# EAGLE design DAQ (EAGLE 6.5.0)
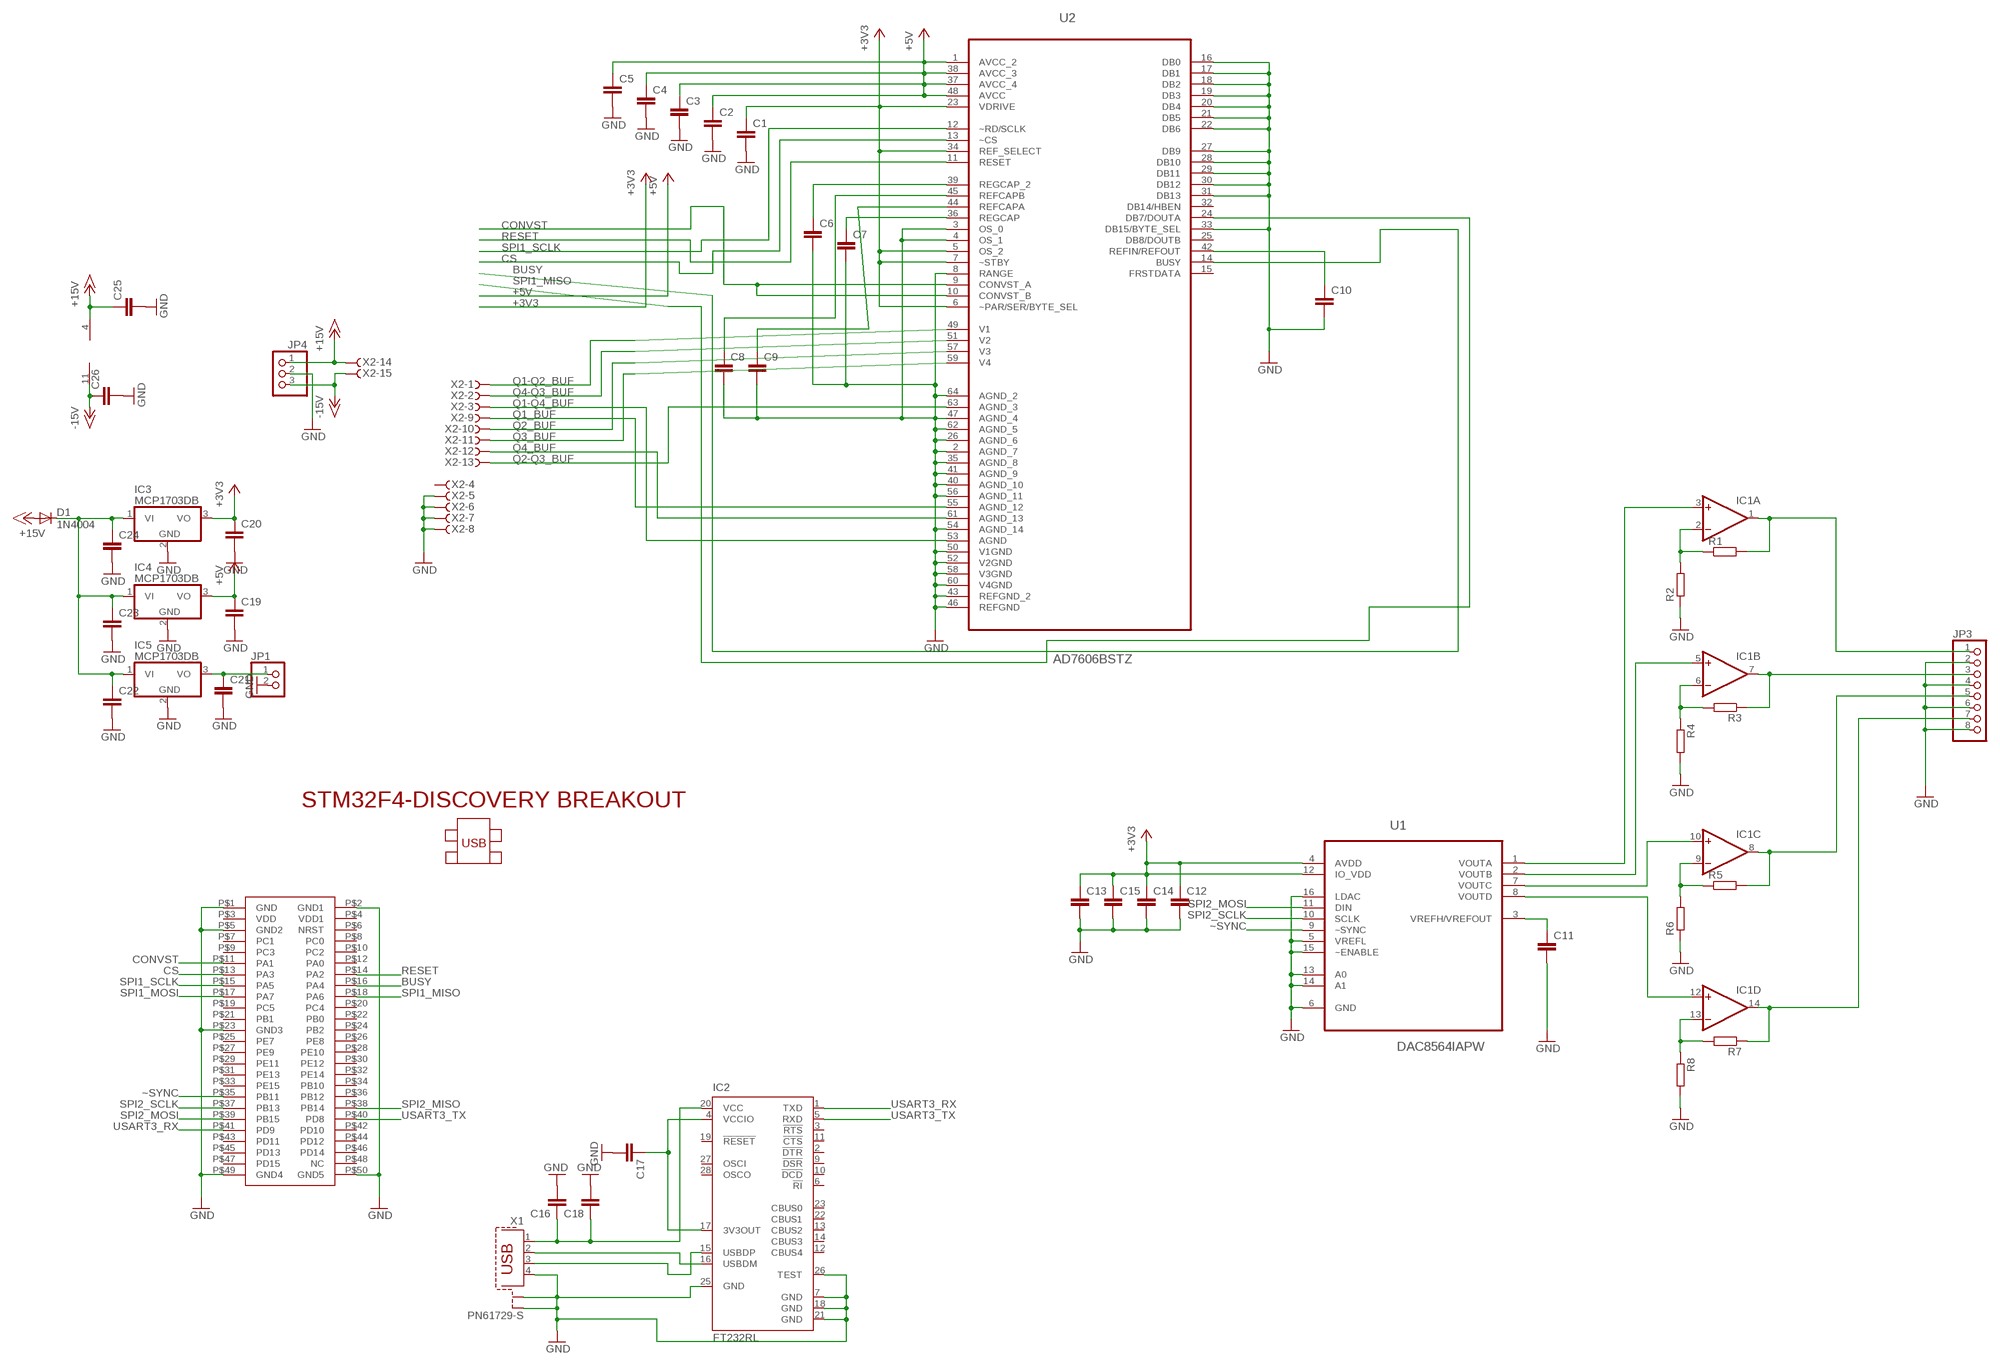
[diagram p0: schematic, sheet 1]

## Parts
C1  C-EUC0805  [C0805]
C2  C-EUC0805  [C0805]
C3  C-EUC0805  [C0805]
C4  C-EUC0805  [C0805]
C5  C-EUC0805  [C0805]
C6  C-EUC0805  [C0805]
C7  C-EUC0805  [C0805]
C8  C-EUC0805K  [C0805K]
C9  C-EUC0805K  [C0805K]
C10  C-EUC0805K  [C0805K]
C11  C-EUC0805  [C0805]
C12  C-EUC0805  [C0805]
C13  C-EUC0805  [C0805]
C14  C-EUC0805  [C0805]
C15  C-EUC0805  [C0805]
C16  C-EUC0805  [C0805]
C17  C-EUC0805  [C0805]
C18  C-EUC0805  [C0805]
C19  C-EUC0805K  [C0805K]
C20  C-EUC0805K  [C0805K]
C21  C-EUC0805K  [C0805K]
C22  C-EUC0805K  [C0805K]
C23  C-EUC0805K  [C0805K]
C24  C-EUC0805K  [C0805K]
C25  C-EUC0805K  [C0805K]
C26  C-EUC0805K  [C0805K]
D1  1N4004  [DO41-10]
IC1  4AMP_P4+11D  [SO14]
IC2  FT232RL  [SSOP28]
IC3  MCP1703DB  [SOT223]
IC4  MCP1703DB  [SOT223]
IC5  MCP1703DB  [SOT223]
JP1  PINHD-1X2  [1X02]
JP3  PINHD-1X8  [1X08]
JP4  PINHD-1X3  [1X03]
R1  R-EU_M0805  [M0805]
R2  R-EU_M0805  [M0805]
R3  R-EU_M0805  [M0805]
R4  R-EU_M0805  [M0805]
R5  R-EU_M0805  [M0805]
R6  R-EU_M0805  [M0805]
R7  R-EU_M0805  [M0805]
R8  R-EU_M0805  [M0805]
U1  DAC8564IAPW  [SOP65P640X120-16N]
U2  AD7606BSTZ  [QFP50P1200X1200X160-64N]
U$1  STM32F4-DISCOVERY  [STM32F4-DISCOVERY]
X1  PN61729-S  [PN61729-S]
X2  F15HDHS  [HDF15H]

## Nets
+3V3: C1.1 C12.1 C13.1 C14.1 C15.1 C20.1 IC3.3(VO) U1.4(AVDD) U1.12(IO_VDD) U2.5(OS_2) U2.6(~PAR/SER/BYTE_SEL) U2.7(~STBY) U2.23(VDRIVE) U2.34(REF_SELECT)
+5V: C2.1 C3.1 C4.1 C5.1 C19.1 IC4.3(VO) U2.1(AVCC_2) U2.37(AVCC_4) U2.38(AVCC_3) U2.48(AVCC)
+15V: C25.1 D1.A IC1.4(P:V+) JP4.1 X2.14
-15V: C26.1 IC1.11(P:V-) JP4.3 X2.15
BUSY: U2.14(BUSY) U$1.P$16(PA4)
CONVST: U2.9(CONVST_A) U2.10(CONVST_B) U$1.P$11(PA1)
CS: U2.13(~CS) U$1.P$13(PA3)
GND: C1.2 C2.2 C3.2 C4.2 C5.2 C6.2 C7.2 C8.2 C9.2 C10.2 C11.2 C12.2 C13.2 C14.2 C15.2 C16.2 C17.2 C18.2 C19.2 C20.2 C21.2 C22.2 C23.2 C24.2 C25.2 C26.2 IC2.7(GND) IC2.18(GND) IC2.21(GND) IC2.25(GND) IC2.26(TEST) IC3.2(GND) IC4.2(GND) IC5.2(GND) JP1.2 JP3.2 JP3.4 JP3.6 JP3.8 JP4.2 R2.1 R4.2 R6.1 R8.2 U1.5(VREFL) U1.6(GND) U1.13(A0) U1.14(A1) U1.15(~ENABLE) U1.16(LDAC) U2.2(AGND_7) U2.3(OS_0) U2.4(OS_1) U2.8(RANGE) U2.16(DB0) U2.17(DB1) U2.18(DB2) U2.19(DB3) U2.20(DB4) U2.21(DB5) U2.22(DB6) U2.26(AGND_6) U2.27(DB9) U2.28(DB10) U2.29(DB11) U2.30(DB12) U2.31(DB13) U2.33(DB15/BYTE_SEL) U2.35(AGND_8) U2.40(AGND_10) U2.41(AGND_9) U2.43(REFGND_2) U2.46(REFGND) U2.47(AGND_4) U2.50(V1GND) U2.52(V2GND) U2.54(AGND_14) U2.56(AGND_11) U2.58(V3GND) U2.60(V4GND) U2.62(AGND_5) U2.64(AGND_2) U$1.P$1(GND) U$1.P$2(GND1) U$1.P$5(GND2) U$1.P$23(GND3) U$1.P$49(GND4) U$1.P$50(GND5) X1.4 X1.S1 X1.S2 X2.5 X2.6 X2.7 X2.8
N$1: C16.1 C18.1 IC2.20(VCC) X1.1
N$2: IC2.16(USBDM) X1.2
N$3: IC2.15(USBDP) X1.3
N$5: IC1.3(A:+IN) U1.1(VOUTA)
N$6: IC1.5(B:+IN) U1.2(VOUTB)
N$7: C7.1 U2.36(REGCAP)
N$8: C8.1 U2.45(REFCAPB)
N$9: C9.1 U2.44(REFCAPA)
N$10: C6.1 U2.39(REGCAP_2)
N$11: C17.1 IC2.4(VCCIO) IC2.17(3V3OUT)
N$12: C21.1 IC5.3(VO) JP1.1
N$15: C10.1 U2.42(REFIN/REFOUT)
N$16: IC1.10(C:+IN) U1.7(VOUTC)
N$17: IC1.12(D:+IN) U1.8(VOUTD)
N$18: C11.1 U1.3(VREFH/VREFOUT)
N$19: IC1.1(A:OUT) JP3.1 R1.2
N$20: IC1.2(A:-IN) R1.1 R2.2
N$21: IC1.7(B:OUT) JP3.3 R3.1
N$22: IC1.6(B:-IN) R3.2 R4.1
N$23: IC1.8(C:OUT) JP3.5 R5.2
N$24: IC1.9(C:-IN) R5.1 R6.2
N$25: IC1.14(D:OUT) JP3.7 R7.1
N$26: IC1.13(D:-IN) R7.2 R8.1
N$29: C22.1 C23.1 C24.1 D1.C IC3.1(VI) IC4.1(VI) IC5.1(VI)
Q1-Q2_BUF: U2.49(V1) X2.1
Q1-Q4_BUF: U2.53(AGND) X2.3
Q1_BUF: U2.55(AGND_12) X2.9
Q2-Q3_BUF: U2.63(AGND_3) X2.13
Q2_BUF: U2.57(V3) X2.10
Q3_BUF: U2.59(V4) X2.11
Q4-Q3_BUF: U2.51(V2) X2.2
Q4_BUF: U2.61(AGND_13) X2.12
RESET: U2.11(RESET) U$1.P$14(PA2)
SPI1_MISO: U2.24(DB7/DOUTA) U$1.P$18(PA6)
SPI1_MOSI: U$1.P$17(PA7)
SPI1_SCLK: U2.12(~RD/SCLK) U$1.P$15(PA5)
SPI2_MISO: U$1.P$38(PB14)
SPI2_MOSI: U1.11(DIN) U$1.P$39(PB15)
SPI2_SCLK: U1.10(SCLK) U$1.P$37(PB13)
USART3_RX: IC2.1(TXD) U$1.P$41(PD9)
USART3_TX: IC2.5(RXD) U$1.P$40(PD8)
~SYNC: U1.9(~SYNC) U$1.P$35(PB11)
Unconnected: IC2.2(!DTR) IC2.3(!RTS) IC2.6(!RI) IC2.9(!DSR) IC2.10(!DCD) IC2.11(!CTS) IC2.12(CBUS4) IC2.13(CBUS2) IC2.14(CBUS3) IC2.19(!RESET) IC2.22(CBUS1) IC2.23(CBUS0) IC2.27(OSCI) IC2.28(OSCO) U2.15(FRSTDATA) U2.25(DB8/DOUTB) U2.32(DB14/HBEN) U$1.P$3(VDD) U$1.P$4(VDD1) U$1.P$6(NRST) U$1.P$7(PC1) U$1.P$8(PC0) U$1.P$9(PC3) U$1.P$10(PC2) U$1.P$12(PA0) U$1.P$19(PC5) U$1.P$20(PC4) U$1.P$21(PB1) U$1.P$22(PB0) U$1.P$24(PB2) U$1.P$25(PE7) U$1.P$26(PE8) U$1.P$27(PE9) U$1.P$28(PE10) U$1.P$29(PE11) U$1.P$30(PE12) U$1.P$31(PE13) U$1.P$32(PE14) U$1.P$33(PE15) U$1.P$34(PB10) U$1.P$36(PB12) U$1.P$42(PD10) U$1.P$43(PD11) U$1.P$44(PD12) U$1.P$45(PD13) U$1.P$46(PD14) U$1.P$47(PD15) U$1.P$48(NC) X2.4

## Library data of the parts
C1-C26 = resistor:C-EU: CAPACITOR, European symbol
D1 = diode:1N4004: DIODE general purpose rectifier, 1 A
IC1 = linear:4AMP_P4+11: OP AMP
IC2 = ftdichip:FT232R: Source: http://www.ftdichip.com/Documents/DataSheets/DS_FT232R_v104.pdf; MPN: FT232RL; OC_FARNELL: 1146032; OC_NEWARK: 91K9918
IC3-IC5 = linear:MCP1703: 250 mA, 16V, Low Quiescent Current LDO Regulator Source: http://ww1.microchip.com/downloads/en/DeviceDoc/22049b.pdf
JP1 = pinhead:PINHD-1X2: PIN HEADER
JP3 = pinhead:PINHD-1X8: PIN HEADER
JP4 = pinhead:PINHD-1X3: PIN HEADER
R1-R8 = resistor:R-EU_: RESISTOR, European symbol
U1 = DAC8564:DAC8564IAPW: DAC; MPN: DAC8564IAPW; OC_FARNELL: 1536691; OC_NEWARK: 65M0703; PACKAGE: TSSOP-16; SUPPLIER: Texas Instruments
U2 = ad7606:AD7606BSTZ: Bipolar Input, Simultaneous Sampling ADC; MPN: AD7606BSTZ; OC_FARNELL: 1864685; OC_NEWARK: 76R7614; PACKAGE: LQFP-64; SUPPLIER: Analog Devices
U$1 = STM32F4-DISCOVERY:STM32F4-DISCOVERY
X1 = con-berg:PN61729-S: BERG USB connector; OC_FARNELL: unknown; OC_NEWARK: unknown
X2 = con-subd:F15?S: SUB-D; OC_FARNELL: unknown; OC_NEWARK: unknown

## Board
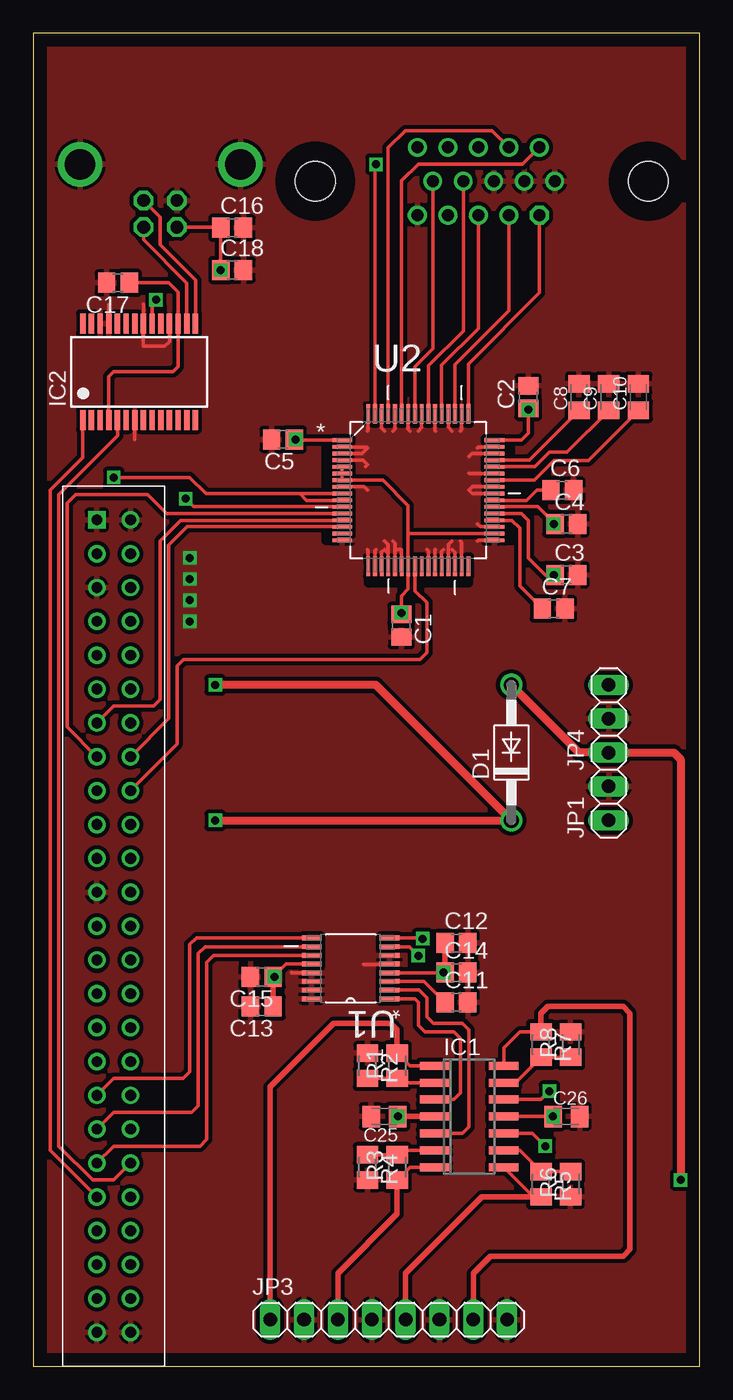
[diagram p1: board, top side]
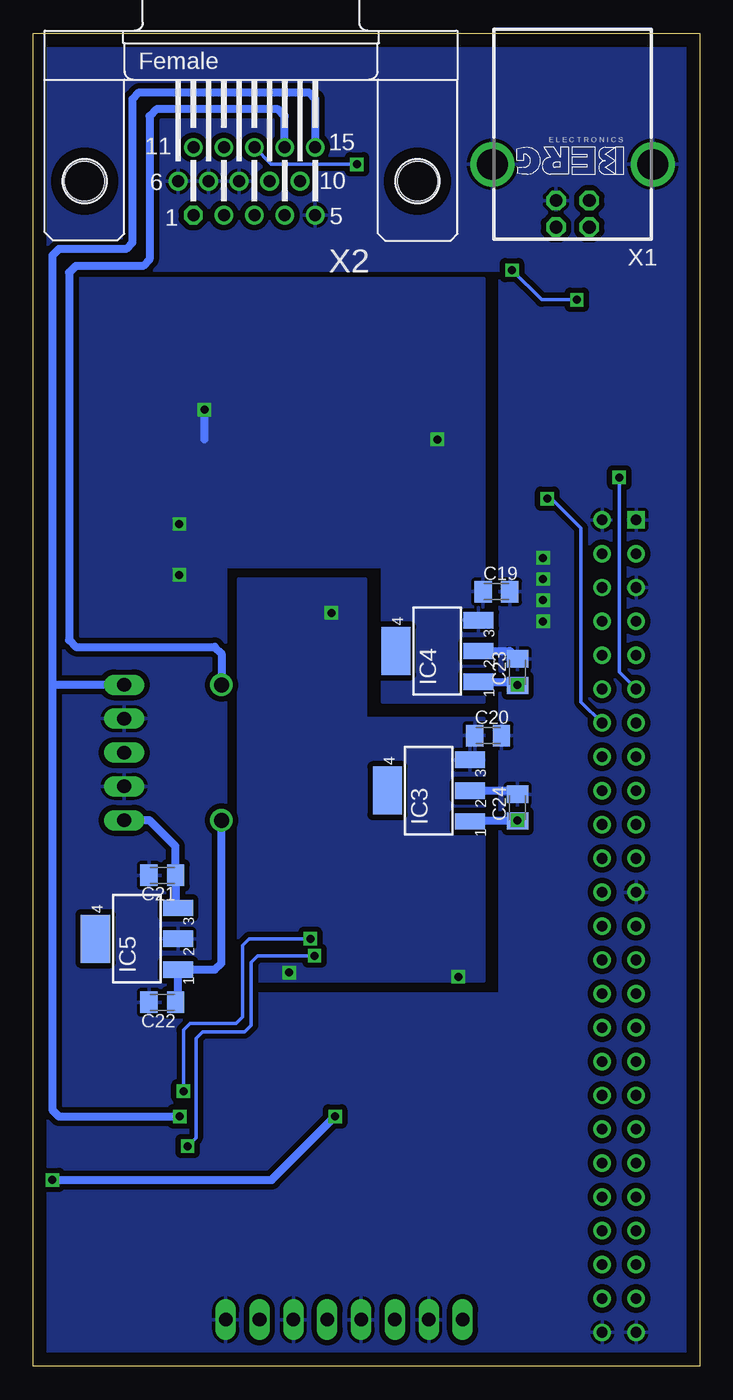
[diagram p2: board, bottom side, seen from below]

Size 50 x 100 mm. Coordinates in mm from the lower left corner, seen from the top.
Outline: 0,0 50,0 50,100 0,100 0,0
Copper layers (1*16): Top 0.035mm / dielectric 1.5mm / Bottom 0.035mm
Design rules "default": minimum track width 10mil, minimum drill 24mil, track to track 8mil, track to pad 8mil, pad to pad 8mil, via to via 8mil, smd to smd 8mil, copper to edge 40mil, drill to drill 8mil, minimum pad ring 10mil, minimum via ring 8mil, stop-mask expansion 4mil, vias tented up to drill 0mil, thermal gap 10mil
tRestrict: area 22.5,67.6 to 23.8,69.5; area 25.1,70.8 to 27,72.1; area 34,68.3 to 35.2,68.9; area 34,65.1 to 35.2,66.4; area 29.5,59.4 to 32.7,60.6; area 25.1,59.4 to 27.6,60.6; area 25.1,59.4 to 25.7,60.6; area 28.9,70.8 to 31.4,72.1; area 25.1,58.7 to 32.7,59.4; area 35.2,61.9 to 35.9,69.5; area 21.9,61.9 to 22.5,69.5

### Footprints (pad centres in the part's own frame; a part is rotated, then mirrored left to right if it is on the bottom)
C0805 = smd 1.3 x 1.5: 1 -0.85,0; 2 0.85,0
C0805K = smd 1.3 x 1.6: 1 -1,0; 2 1,0
DO41-10 = drill 1.118: A 5.08,0; C -5.08,0
SO14 = smd 0.6 x 2.2: 1 -3.81,-2.6; 2 -2.54,-2.6; 3 -1.27,-2.6; 4 0,-2.6; 5 1.27,-2.6; 6 2.54,-2.6; 7 3.81,-2.6; 8 3.81,2.6; 9 2.54,2.6; 10 1.27,2.6; 11 0,2.6; 12 -1.27,2.6; 13 -2.54,2.6; 14 -3.81,2.6
SSOP28 = smd 0.4 x 1.5: 1 -4.225,-3.625; 2 -3.575,-3.625; 3 -2.925,-3.625; 4 -2.275,-3.625; 5 -1.625,-3.625; 6 -0.975,-3.625; 7 -0.325,-3.625; 8 0.325,-3.625; 9 0.975,-3.625; 10 1.625,-3.625; 11 2.275,-3.625; 12 2.925,-3.625; 13 3.575,-3.625; 14 4.225,-3.625; 15 4.225,3.625; 16 3.575,3.625; 17 2.925,3.625; 18 2.275,3.625; 19 1.625,3.625; 20 0.975,3.625; 21 0.325,3.625; 22 -0.325,3.625; 23 -0.975,3.625; 24 -1.625,3.625; 25 -2.275,3.625; 26 -2.925,3.625; 27 -3.575,3.625; 28 -4.225,3.625
SOT223 = smd 1.219 x 2.235: 1 -2.311,-3.099; 2 0,-3.099; 3 2.311,-3.099 | smd 3.6 x 2.2: 4 0,3.099
1X02 = drill 1.016 long: 1 -1.27,0; 2 1.27,0
1X08 = drill 1.016 long: 1 -8.89,0; 2 -6.35,0; 3 -3.81,0; 4 -1.27,0; 5 1.27,0; 6 3.81,0; 7 6.35,0; 8 8.89,0
1X03 = drill 1.016 long: 1 -2.54,0; 2 0,0; 3 2.54,0
M0805 = smd 1.3 x 1.6: 1 -0.95,0; 2 0.95,0
SOP65P640X120-16N = smd 1.473 x 0.356: 1 -2.921,2.286; 2 -2.921,1.626; 3 -2.921,0.965; 4 -2.921,0.33; 5 -2.921,-0.33; 6 -2.921,-0.965; 7 -2.921,-1.626; 8 -2.921,-2.286; 9 2.921,-2.286; 10 2.921,-1.626; 11 2.921,-0.965; 12 2.921,-0.33; 13 2.921,0.33; 14 2.921,0.965; 15 2.921,1.626; 16 2.921,2.286
QFP50P1200X1200X160-64N = smd 1.473 x 0.279: 1 -5.715,3.759; 2 -5.715,3.251; 3 -5.715,2.743; 4 -5.715,2.261; 5 -5.715,1.753; 6 -5.715,1.245; 7 -5.715,0.762; 8 -5.715,0.254; 9 -5.715,-0.254; 10 -5.715,-0.762; 11 -5.715,-1.245; 12 -5.715,-1.753; 13 -5.715,-2.261; 14 -5.715,-2.743; 15 -5.715,-3.251; 16 -5.715,-3.759; 33 5.715,-3.759; 34 5.715,-3.251; 35 5.715,-2.743; 36 5.715,-2.261; 37 5.715,-1.753; 38 5.715,-1.245; 39 5.715,-0.762; 40 5.715,-0.254; 41 5.715,0.254; 42 5.715,0.762; 43 5.715,1.245; 44 5.715,1.753; 45 5.715,2.261; 46 5.715,2.743; 47 5.715,3.251; 48 5.715,3.759 | smd 0.279 x 1.473: 17 -3.759,-5.715; 18 -3.251,-5.715; 19 -2.743,-5.715; 20 -2.261,-5.715; 21 -1.753,-5.715; 22 -1.245,-5.715; 23 -0.762,-5.715; 24 -0.254,-5.715; 25 0.254,-5.715; 26 0.762,-5.715; 27 1.245,-5.715; 28 1.753,-5.715; 29 2.261,-5.715; 30 2.743,-5.715; 31 3.251,-5.715; 32 3.759,-5.715; 49 3.759,5.715; 50 3.251,5.715; 51 2.743,5.715; 52 2.261,5.715; 53 1.753,5.715; 54 1.245,5.715; 55 0.762,5.715; 56 0.254,5.715; 57 -0.254,5.715; 58 -0.762,5.715; 59 -1.245,5.715; 60 -1.753,5.715; 61 -2.261,5.715; 62 -2.743,5.715; 63 -3.251,5.715; 64 -3.759,5.715
STM32F4-DISCOVERY = drill 0.8 square: P$1 -1.27,30.48 | drill 0.8: P$2 1.27,30.48; P$3 -1.27,27.94; P$4 1.27,27.94; P$5 -1.27,25.4; P$6 1.27,25.4; P$7 -1.27,22.86; P$8 1.27,22.86; P$9 -1.27,20.32; P$10 1.27,20.32; P$11 -1.27,17.78; P$12 1.27,17.78; P$13 -1.27,15.24; P$14 1.27,15.24; P$15 -1.27,12.7; P$16 1.27,12.7; P$17 -1.27,10.16; P$18 1.27,10.16; P$19 -1.27,7.62; P$20 1.27,7.62; P$21 -1.27,5.08; P$22 1.27,5.08; P$23 -1.27,2.54; P$24 1.27,2.54; P$25 -1.27,0; P$26 1.27,0; P$27 -1.27,-2.54; P$28 1.27,-2.54; P$29 -1.27,-5.08; P$30 1.27,-5.08; P$31 -1.27,-7.62; P$32 1.27,-7.62; P$33 -1.27,-10.16; P$34 1.27,-10.16; P$35 -1.27,-12.7; P$36 1.27,-12.7; P$37 -1.27,-15.24; P$38 1.27,-15.24; P$39 -1.27,-17.78; P$40 1.27,-17.78; P$41 -1.27,-20.32; P$42 1.27,-20.32; P$43 -1.27,-22.86; P$44 1.27,-22.86; P$45 -1.27,-25.4; P$46 1.27,-25.4; P$47 -1.27,-27.94; P$48 1.27,-27.94; P$49 -1.27,-30.48; P$50 1.27,-30.48
PN61729-S = drill 0.95 octagon: 1 1.25,4.71; 2 -1.25,4.71; 3 -1.25,2.71; 4 1.25,2.71 | drill 2.3 pad 2.9: S1 -6.02,0; S2 6.02,0
HDF15H = drill 0.9 octagon: 1 4.329,2.54 | drill 0.9: 2 2.043,2.54; 3 -0.243,2.54; 4 -2.529,2.54; 5 -4.815,2.54; 6 5.472,0; 7 3.186,0; 8 0.9,0; 9 -1.386,0; 10 -3.672,0; 11 4.329,-2.54; 12 2.043,-2.54; 13 -0.243,-2.54; 14 -2.529,-2.54; 15 -4.815,-2.54 | hole 3: -12.5,0; 12.5,0

### Placement (x,y rotation side)
C1  27.62,55.56 270 top
C2  37.15,72.71 90 top
C3  40.01,59.37 0 top
C4  40.01,63.18 0 top
C5  18.73,69.53 180 top
C6  39.69,65.72 0 top
C7  39.05,56.83 0 top
C8  40.96,72.71 90 top
C9  43.18,72.71 90 top
C10  45.4,72.71 90 top
C11  31.75,27.3 0 top
C12  31.75,31.75 0 top
C13  17.14,26.99 180 top
C14  31.75,29.53 0 top
C15  17.14,29.21 180 top
C16  14.92,85.41 0 top
C17  6.35,81.28 180 top
C18  14.92,82.23 0 top
C19  15.24,58.1 0 bottom
C20  15.88,47.31 0 bottom
C21  40.32,36.83 180 bottom
C22  40.32,27.3 180 bottom
C23  13.65,52.07 90 bottom
C24  13.65,41.91 90 bottom
C25  26.35,18.73 180 top
C26  40.01,18.73 0 top
D1  35.88,46.04 90 top
IC1  32.7,18.73 270 top
IC2  7.94,74.61 0 top
IC3  20.32,43.18 90 bottom
IC4  19.68,53.66 90 bottom
IC5  42.23,32.07 90 bottom
JP1  43.18,42.23 90 top
JP3  26.67,3.49 0 top
JP4  43.18,48.58 90 top
R1  27.3,22.54 90 top
R2  25.08,22.54 270 top
R3  27.3,14.92 90 top
R4  25.08,14.92 270 top
R5  38.1,13.65 270 top
R6  40.32,13.65 90 top
R7  38.1,24.13 270 top
R8  40.32,24.13 90 top
U1  23.81,29.84 180 top
U2  28.89,65.72 0 top
U$1  6.03,33.02 0 top
X1  9.53,90.17 180 bottom
X2  33.66,88.9 180 bottom

### Tracks (layer width: path | path; a pad name or v marks a point on that pad's centre or on a via)
+3V3  (via drill 0.6)
  Top 0.254: 28.13,56.92 C1.1 | v27.62,56.52 27.62,57.78 28.13,58.29 U2.23 28.13,62.55 | 28.13,62.55 28.13,64.58 26.23,66.48 U2.7 U2.6 U2.5 | U2.34 28.21,62.47 28.13,62.55 | U1.12 18.96,30.18 C15.1 v18.1,29.21 | U1.4 30.81,29.52 | C14.1 30.89,29.52 30.81,29.52 | 30.81,29.52 v30.8,29.53
  Top 0.406: C15.1 C13.1 | C12.1 C14.1
  Top 0.61: C1.1 v27.62,56.52
  pour Bottom (isolate 0.406): 16.19,48.58 25.08,48.58 25.08,59.05 34.61,59.05 34.61,28.89 16.19,28.89
+5V  (via drill 0.6)
  Top 0: v19.68,69.53 C5.1 | v39.05,63.18 C4.1 | v39.05,59.37 C3.1
  Top 0.254: 19.58,69.48 C5.1 | 37.15,70.75 v37.15,71.75 | v37.15,71.75 C2.1 | U2.48 36.64,69.48 37.15,69.99 v37.15,71.75 | U2.38 37.86,64.48 C4.1 | U2.37 36.64,63.97 37.15,63.46 37.15,60.64 38.42,59.37 v39.05,59.37 | U2.1 20.05,69.48 v19.68,69.53
  Bottom 0.61: 37.15,69.53 v37.15,71.75
  pour Bottom (isolate 0.406): 16.19,81.6 50.16,81.6 50.16,54.29 35.56,54.29 35.56,60.01 23.81,60.01 23.81,49.85 16.19,49.85
+15V  (via drill 0.6)
  Top 0.406: 27.3,18.73 IC1.4
  Top 0.61: D1.A 40.96,46.04 JP4.1 48.08,46.04 48.58,45.54 v48.58,13.97 | C25.1 27.3,18.73
  Bottom 0.61: D1.A 35.88,53.48 36.38,53.98 46.81,53.98 47.31,54.48 47.31,82.05 46.81,82.55 41.77,82.55 41.27,83.05 41.27,93.8 40.77,94.3 31.63,94.3 31.13,93.8 X2.14 | v48.58,13.97 32.12,13.97 C25.1
  other vias: 27.35,18.73
-15V  (via drill 0.6)
  Top 0.254: IC1.11 39.05,18.73
  Top 0.61: C26.1 39.05,18.73
  Bottom 0.61: X2.15 28.84,95.07 29.34,95.57 42.05,95.57 42.55,95.07 42.55,84.32 43.05,83.82 48.08,83.82 48.58,83.32 48.58,51.12 | JP4.3 48.58,51.12 | 48.58,51.12 48.58,19.23 48.08,18.73 C26.1
  other vias: 39.01,18.73
BUSY
  Top 0.254: U$1.P$16 10.16,48.58 10.16,61.59 11.54,62.98 U2.14
CONVST  (via drill 0.6)
  Top 0.254: U2.9 20,65.47 | U2.10 20.51,64.96 20,65.47 | 20,65.47 12.95,65.47 11.75,66.67 v6.03,66.67
  Bottom 0.254: v6.03,66.67 6.03,52.07 U$1.P$11
CS
  Top 0.254: U2.13 11.07,63.46 9.53,61.91 9.53,50.03 9.03,49.53 6.03,49.53 U$1.P$13
GND  (via drill 0.6)
  Top 0.254: U2.47 33.41,68.97 33.34,68.9 | U2.46 32.91,68.47 32.7,68.26 | U2.43 32.73,66.97 32.7,66.99 | U2.41 32.96,65.98 32.7,65.72 32.96,65.47 U2.40 | U2.35 33.54,62.98 33.34,63.18 | U2.64 25.13,70.22 25.08,70.17 | U2.62 26.15,70.37 26.35,70.17 | U2.60 27.14,70.32 26.99,70.17 | U2.58 28.13,70.29 28.26,70.17 | U2.56 29.15,70.42 28.89,70.17 | U2.54 30.14,70.19 30.16,70.17 | U2.52 31.15,70.45 31.43,70.17 | U2.50 32.14,70.24 32.07,70.17 | U2.2 25.01,68.97 25.08,68.9 24.65,68.47 U2.3 | U2.4 24.73,67.98 25.08,67.63 24.93,67.47 | U2.8 24.83,65.98 25.08,65.72 | U2.26 29.65,61.15 29.53,61.28 | U2.33 33.39,61.96 33.34,61.91 | U2.17 25.13,61.23 25.08,61.28 | U2.18 25.64,61.2 25.72,61.28 | U2.19 26.15,61.07 26.35,61.28 26.63,61 U2.20 26.63,61.63 26.35,61.91 | U2.21 27.14,61.28 | 27.14,61.28 27.14,61.76 26.99,61.91 | U2.22 27.65,61.25 27.62,61.28 27.14,61.28 | U2.27 30.14,61.25 30.16,61.28 | U2.28 30.64,61.12 30.8,61.28 | U2.29 31.15,61.63 31.43,61.91 | U2.30 31.64,61.07 31.43,61.28 | U2.31 32.14,61.84 32.07,61.91 | IC2.25 5.66,79.64 5.71,79.69 | 8.26,79.69 IC2.21 8.26,76.52 9.84,76.52 10.21,76.89 IC2.18 | IC2.7 7.61,69.54 7.62,69.53 | U1.13 19.38,29.52 19.37,29.53 | U1.5 26.72,30.16 24.77,30.16
  Bottom 0.61: IC3.2 13.92,43.18 C24.2 | IC4.2 14.24,53.66 C23.2
  other vias: 11.75,60.64 11.75,59.05 11.75,57.47 11.75,55.88
  pour Top (isolate 0.305): 0,100.01 50.16,100.01 50.16,0 0,0
  pour Bottom (isolate 0.406): 0,100.01 49.85,100.01 50.16,82.23 15,82.23 15,27.94 35.56,27.94 35.56,53.66 50.16,53.66 50.16,0 0,0
N$1  (via drill 0.6)
  Top 0.254: X1.1 14.02,85.46 C16.1 C18.1 | IC2.20 8.91,79.72 v9.21,80.01
  Bottom 0.254: v9.21,80.01 11.85,80.01 C18.1
  other vias: 14.07,82.23
N$2
  Top 0.254: IC2.16 11.51,81.27 8.28,84.51 X1.2
N$3
  Top 0.254: IC2.15 12.16,81.5 9.53,84.14 9.53,86.21 X1.3
N$5
  Top 0.254: U1.1 28.64,27.56 28.89,27.3 28.89,25.58 29.39,25.08 31.57,25.08 32.07,24.58 32.07,20.5 31.57,20 IC1.3
N$6
  Top 0.254: U1.2 28.93,28.22 29.53,27.62 29.53,26.22 30.03,25.72 32.2,25.72 32.7,25.22 32.7,17.96 32.2,17.46 IC1.5
N$7
  Top 0.254: U2.36 35.92,63.46 36.51,62.87 36.51,58.52 C7.1
N$8
  Top 0.254: U2.45 37.23,67.98 C8.1
N$9
  Top 0.254: U2.44 37.63,67.47 38.73,68.58 40.05,68.58 C9.1
N$10
  Top 0.254: U2.39 37.02,64.96 37.78,65.72 C6.1
N$11
  Top 0.254: IC2.4 5.66,74.24 6.03,74.61 10.48,74.61 10.86,75 IC2.17 10.86,80.58 10.16,81.28 C17.1
N$12
  Bottom 0.61: JP1.1 41.27,40.96 39.32,39.01 C21.1 39.32,34.57 IC5.3
N$15
  Top 0.254: U2.42 37.59,66.48 39.05,67.94 41.64,67.94 C10.1
N$16  (via drill 0.6)
  Top 0.254: U1.7 28.22,31.47 v28.89,30.8 | v38.42,16.51 37.47,17.46 IC1.10
  Bottom 0.254: v28.89,30.8 33.16,30.8 33.66,30.3 33.66,25.58 34.16,25.08 37.28,25.08 37.78,24.58 37.78,17.14 v38.42,16.51
N$17  (via drill 0.6)
  Top 0.254: U1.8 29.15,32.13 v29.21,32.07 | v38.73,20.64 38.1,20 IC1.12
  Bottom 0.254: v29.21,32.07 33.79,32.07 34.29,31.57 34.29,26.22 34.79,25.72 38.23,25.72 38.73,25.22 v38.73,20.64
N$18
  Top 0.254: U1.3 29.32,28.88 C11.1
N$19
  Top 0.254: IC1.1 28.25,22.54 R1.2
  Top 0.406: R1.2 27.3,25.22 26.8,25.72 22.54,25.72 17.78,20.95 JP3.1
N$20
  Top 0.254: IC1.2 27.62,21.27 R1.1 R2.2
N$21
  Top 0.254: IC1.7 28.25,14.92 R3.1
  Top 0.406: R3.1 27.3,11.43 22.86,6.99 JP3.3
N$22
  Top 0.254: IC1.6 27.62,16.19 R3.2 R4.1
N$23
  Top 0.254: R5.2 37.52,12.7 IC1.8
  Top 0.406: 37.52,12.7 33.66,12.7 27.94,6.99 JP3.5
N$24
  Top 0.254: IC1.9 36.51,16.19 R5.1 R6.2
N$25
  Top 0.254: IC1.14 35.3,23.87 36.51,25.08 R7.1
  Top 0.406: JP3.7 33.02,6.99 34.29,8.26 44.27,8.26 44.77,8.76 44.77,26.49 44.27,26.99 38.6,26.99 38.1,26.49 R7.1
N$26
  Top 0.254: IC1.13 36.19,21.27 R7.2 R8.1
N$29  (via drill 0.6)
  Top 0.61: v13.65,40.96 D1.C 25.72,51.12 v13.65,51.12
  Bottom 0.61: D1.C 35.88,30.26 36.38,29.76 IC5.1 39.13,27.3 C22.1 | IC3.1 17.18,40.91 C24.1 v13.65,40.96 | IC4.1 13.88,51.35 v13.65,51.12 C23.1
Q1-Q2_BUF
  Top 0.254: U2.49 32.65,75.2 37.98,80.53 X2.1
Q1-Q4_BUF
  Top 0.254: U2.53 30.64,75.09 33.41,77.86 X2.3
Q1_BUF
  Top 0.254: U2.55 29.65,75.06 32.27,77.67 X2.9
Q2-Q3_BUF  (via drill 0.6)
  Top 0.254: U2.63 25.64,90.09 v25.72,90.17
  Bottom 0.254: v25.72,90.17 32.14,90.17 X2.13
Q2_BUF
  Top 0.254: U2.57 28.64,74.99 29.98,76.34 X2.10
Q3_BUF
  Top 0.254: U2.59 27.65,88.92 28.89,90.17 36.71,90.17 X2.11
Q4-Q3_BUF
  Top 0.254: X2.2 35.7,79.19 31.64,75.13 U2.51
Q4_BUF
  Top 0.254: U2.61 26.63,91.4 27.94,92.71 34.43,92.71 X2.12
RESET  (via drill 0.6)
  Top 0.254: U2.11 12.04,64.48 v11.43,65.09
  Bottom 0.254: v11.43,65.09 11.11,65.09 8.89,62.87 8.89,49.85 U$1.P$14
SPI1_MISO
  Top 0.254: U2.24 28.64,58.17 29.53,57.28 29.53,53.53 29.02,53.02 11.29,53.02 10.79,52.52 10.79,46.67 U$1.P$18
SPI1_SCLK
  Top 0.254: U2.12 10.01,63.97 8.57,65.41 3.17,65.41 2.54,64.77 2.54,47.94 U$1.P$15
SPI2_MOSI
  Top 0.254: U1.11 13.52,30.81 13.02,30.31 13.02,17.01 12.52,16.51 6.03,16.51 U$1.P$39
SPI2_SCLK
  Top 0.254: U$1.P$37 6.03,19.05 11.88,19.05 12.38,19.55 12.38,30.97 12.88,31.47 U1.10
USART3_RX
  Top 0.254: IC2.1 3.71,68.17 1.27,65.72 1.27,16.19 U$1.P$41
USART3_TX
  Top 0.254: IC2.5 6.31,69.81 1.91,65.41 1.91,16.51 4.45,13.97 6.03,13.97 U$1.P$40
~SYNC
  Top 0.254: U$1.P$35 6.03,21.59 11.25,21.59 11.75,22.09 11.75,31.63 12.25,32.13 U1.9